# EAGLE design PCB-BI8-2x5RGB (EAGLE 6.4)

## Sheet 1 of 2
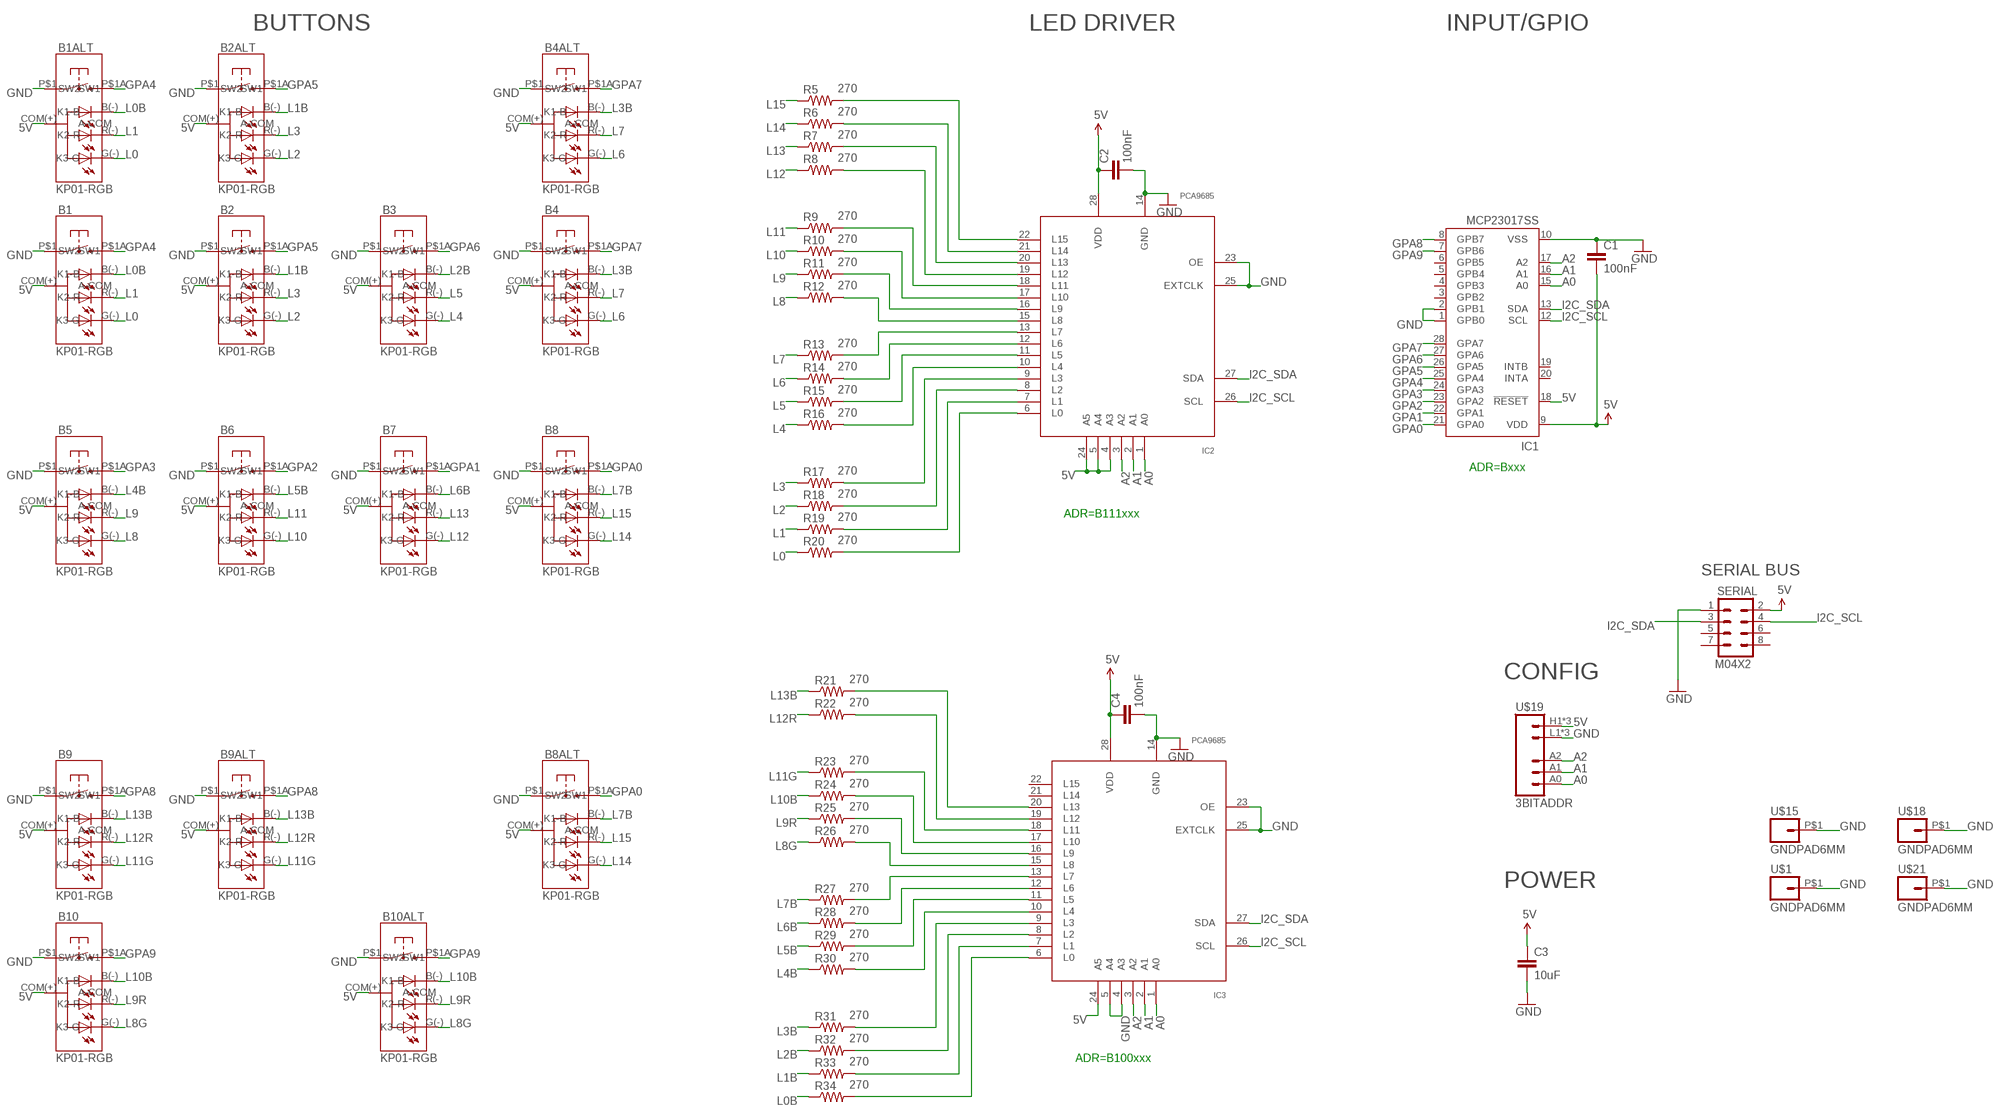
[diagram p0: schematic, sheet 1]

### Parts
B1  KP01-RGB  NKK-KP01  [NKK-KP01]
B1ALT  KP01-RGB  NKK-KP01  [NKK-KP01]
B2  KP01-RGB  NKK-KP01  [NKK-KP01]
B2ALT  KP01-RGB  NKK-KP01  [NKK-KP01]
B3  KP01-RGB  NKK-KP01  [NKK-KP01]
B4  KP01-RGB  NKK-KP01  [NKK-KP01]
B4ALT  KP01-RGB  NKK-KP01  [NKK-KP01]
B5  KP01-RGB  NKK-KP01  [NKK-KP01]
B6  KP01-RGB  NKK-KP01  [NKK-KP01]
B7  KP01-RGB  NKK-KP01  [NKK-KP01]
B8  KP01-RGB  NKK-KP01  [NKK-KP01]
B8ALT  KP01-RGB  NKK-KP01  [NKK-KP01]
B9  KP01-RGB  NKK-KP01  [NKK-KP01]
B9ALT  KP01-RGB  NKK-KP01  [NKK-KP01]
B10  KP01-RGB  NKK-KP01  [NKK-KP01]
B10ALT  KP01-RGB  NKK-KP01  [NKK-KP01]
C1  100nF  CAP0603-CAP  [0603-CAP]
C2  100nF  CAP0603-CAP  [0603-CAP]
C3  10uF  CAP0805  [0805]
C4  100nF  CAP0603-CAP  [0603-CAP]
IC1  MCP23017SS  [SSOP28]
IC2  PCA9685  [TSSOP28]
IC3  PCA9685  [TSSOP28]
R5  270  RESISTOR0603-RES  [0603-RES]
R6  270  RESISTOR0603-RES  [0603-RES]
R7  270  RESISTOR0603-RES  [0603-RES]
R8  270  RESISTOR0603-RES  [0603-RES]
R9  270  RESISTOR0603-RES  [0603-RES]
R10  270  RESISTOR0603-RES  [0603-RES]
R11  270  RESISTOR0603-RES  [0603-RES]
R12  270  RESISTOR0603-RES  [0603-RES]
R13  270  RESISTOR0603-RES  [0603-RES]
R14  270  RESISTOR0603-RES  [0603-RES]
R15  270  RESISTOR0603-RES  [0603-RES]
R16  270  RESISTOR0603-RES  [0603-RES]
R17  270  RESISTOR0603-RES  [0603-RES]
R18  270  RESISTOR0603-RES  [0603-RES]
R19  270  RESISTOR0603-RES  [0603-RES]
R20  270  RESISTOR0603-RES  [0603-RES]
R21  270  RESISTOR0603-RES  [0603-RES]
R22  270  RESISTOR0603-RES  [0603-RES]
R23  270  RESISTOR0603-RES  [0603-RES]
R24  270  RESISTOR0603-RES  [0603-RES]
R25  270  RESISTOR0603-RES  [0603-RES]
R26  270  RESISTOR0603-RES  [0603-RES]
R27  270  RESISTOR0603-RES  [0603-RES]
R28  270  RESISTOR0603-RES  [0603-RES]
R29  270  RESISTOR0603-RES  [0603-RES]
R30  270  RESISTOR0603-RES  [0603-RES]
R31  270  RESISTOR0603-RES  [0603-RES]
R32  270  RESISTOR0603-RES  [0603-RES]
R33  270  RESISTOR0603-RES  [0603-RES]
R34  270  RESISTOR0603-RES  [0603-RES]
SERIAL  M04X2  [2X4]
U$1  GNDPAD6MM  [3.2MMPAD6MM]
U$15  GNDPAD6MM  [3.2MMPAD6MM]
U$18  GNDPAD6MM  [3.2MMPAD6MM]
U$19  3BITADDR  [3BITADDR]
U$21  GNDPAD6MM  [3.2MMPAD6MM]

### Nets
5V [Power]: B1.COM(+)(A-COM) B1ALT.COM(+)(A-COM) B2.COM(+)(A-COM) B2ALT.COM(+)(A-COM) B3.COM(+)(A-COM) B4.COM(+)(A-COM) B4ALT.COM(+)(A-COM) B5.COM(+)(A-COM) B6.COM(+)(A-COM) B7.COM(+)(A-COM) B8.COM(+)(A-COM) B8ALT.COM(+)(A-COM) B9.COM(+)(A-COM) B9ALT.COM(+)(A-COM) B10.COM(+)(A-COM) B10ALT.COM(+)(A-COM) C1.2 C2.1 C3.1 C4.1 IC1.9(VDD) IC1.18(!RESET) IC2.4(A3) IC2.5(A4) IC2.24(A5) IC2.28(VDD) IC3.24(A5) IC3.28(VDD) SERIAL.2 U$19.H1(VCC) U$19.H2(VCC) U$19.H3(VCC)
A0: IC1.15(A0) IC2.1(A0) IC3.1(A0) U$19.A0
A1: IC1.16(A1) IC2.2(A1) IC3.2(A1) U$19.A1
A2: IC1.17(A2) IC2.3(A2) IC3.3(A2) U$19.A2
GND [Power]: B1.P$1(SW1) B1ALT.P$1(SW1) B2.P$1(SW1) B2ALT.P$1(SW1) B3.P$1(SW1) B4.P$1(SW1) B4ALT.P$1(SW1) B5.P$1(SW1) B6.P$1(SW1) B7.P$1(SW1) B8.P$1(SW1) B8ALT.P$1(SW1) B9.P$1(SW1) B9ALT.P$1(SW1) B10.P$1(SW1) B10ALT.P$1(SW1) C1.1 C2.2 C3.2 C4.2 IC1.1(GPB0) IC1.2(GPB1) IC1.10(VSS) IC2.14(GND) IC2.23(OE) IC2.25(EXTCLK) IC3.4(A3) IC3.5(A4) IC3.14(GND) IC3.23(OE) IC3.25(EXTCLK) SERIAL.1 U$1.P$1 U$15.P$1 U$18.P$1 U$19.L1(GND) U$19.L2(GND) U$19.L3(GND) U$21.P$1
GPA0: B8.P$1A(SW2) B8ALT.P$1A(SW2) IC1.21(GPA0)
GPA1: B7.P$1A(SW2) IC1.22(GPA1)
GPA2: B6.P$1A(SW2) IC1.23(GPA2)
GPA3: B5.P$1A(SW2) IC1.24(GPA3)
GPA4: B1.P$1A(SW2) B1ALT.P$1A(SW2) IC1.25(GPA4)
GPA5: B2.P$1A(SW2) B2ALT.P$1A(SW2) IC1.26(GPA5)
GPA6: B3.P$1A(SW2) IC1.27(GPA6)
GPA7: B4.P$1A(SW2) B4ALT.P$1A(SW2) IC1.28(GPA7)
GPA8: B9.P$1A(SW2) B9ALT.P$1A(SW2) IC1.8(GPB7)
GPA9: B10.P$1A(SW2) B10ALT.P$1A(SW2) IC1.7(GPB6)
I2C_SCL: IC1.12(SCL) IC2.26(SCL) IC3.26(SCL) SERIAL.4
I2C_SDA: IC1.13(SDA) IC2.27(SDA) IC3.27(SDA) SERIAL.3
L0: B1.G(-)(K3-G) B1ALT.G(-)(K3-G) R20.1
L0B: B1.B(-)(K1-B) B1ALT.B(-)(K1-B) R34.1
L1: B1.R(-)(K2-R) B1ALT.R(-)(K2-R) R19.1
L1B: B2.B(-)(K1-B) B2ALT.B(-)(K1-B) R33.1
L2: B2.G(-)(K3-G) B2ALT.G(-)(K3-G) R18.1
L2B: B3.B(-)(K1-B) R32.1
L3: B2.R(-)(K2-R) B2ALT.R(-)(K2-R) R17.1
L3B: B4.B(-)(K1-B) B4ALT.B(-)(K1-B) R31.1
L4: B3.G(-)(K3-G) R16.1
L4B: B5.B(-)(K1-B) R30.1
L5: B3.R(-)(K2-R) R15.1
L5B: B6.B(-)(K1-B) R29.1
L6: B4.G(-)(K3-G) B4ALT.G(-)(K3-G) R14.1
L6B: B7.B(-)(K1-B) R28.1
L7: B4.R(-)(K2-R) B4ALT.R(-)(K2-R) R13.1
L7B: B8.B(-)(K1-B) B8ALT.B(-)(K1-B) R27.1
L8: B5.G(-)(K3-G) R12.1
L8G: B10.G(-)(K3-G) B10ALT.G(-)(K3-G) R26.1
L9: B5.R(-)(K2-R) R11.1
L9R: B10.R(-)(K2-R) B10ALT.R(-)(K2-R) R25.1
L10: B6.G(-)(K3-G) R10.1
L10B: B10.B(-)(K1-B) B10ALT.B(-)(K1-B) R24.1
L11: B6.R(-)(K2-R) R9.1
L11G: B9.G(-)(K3-G) B9ALT.G(-)(K3-G) R23.1
L12: B7.G(-)(K3-G) R8.1
L12R: B9.R(-)(K2-R) B9ALT.R(-)(K2-R) R22.1
L13: B7.R(-)(K2-R) R7.1
L13B: B9.B(-)(K1-B) B9ALT.B(-)(K1-B) R21.1
L14: B8.G(-)(K3-G) B8ALT.G(-)(K3-G) R6.1
L15: B8.R(-)(K2-R) B8ALT.R(-)(K2-R) R5.1
N$2: IC3.13(L7) R27.2
N$3: IC3.12(L6) R28.2
N$4: IC2.13(L7) R13.2
N$5: IC2.12(L6) R14.2
N$6: IC3.11(L5) R29.2
N$7: IC2.11(L5) R15.2
N$9: IC2.10(L4) R16.2
N$10: IC2.9(L3) R17.2
N$11: IC2.8(L2) R18.2
N$12: IC2.7(L1) R19.2
N$13: IC3.10(L4) R30.2
N$14: IC3.9(L3) R31.2
N$15: IC3.8(L2) R32.2
N$16: IC3.7(L1) R33.2
N$17: IC3.6(L0) R34.2
N$18: IC3.15(L8) R26.2
N$19: IC2.6(L0) R20.2
N$20: IC2.15(L8) R12.2
N$21: IC2.16(L9) R11.2
N$22: IC2.17(L10) R10.2
N$23: IC2.18(L11) R9.2
N$24: IC2.19(L12) R8.2
N$25: IC2.20(L13) R7.2
N$26: IC2.21(L14) R6.2
N$27: IC2.22(L15) R5.2
N$28: IC3.16(L9) R25.2
N$29: IC3.17(L10) R24.2
N$30: IC3.18(L11) R23.2
N$31: IC3.19(L12) R22.2
N$32: IC3.20(L13) R21.2
Unconnected: IC1.3(GPB2) IC1.4(GPB3) IC1.5(GPB4) IC1.6(GPB5) IC1.19(INTB) IC1.20(INTA) IC3.21(L14) IC3.22(L15) SERIAL.5 SERIAL.6 SERIAL.7 SERIAL.8

### Notes on the sheet
- BUTTONS | LED DRIVER | INPUT/GPIO
- ADR=Bxxx
- ADR=B111xxx
- SERIAL BUS
- CONFIG
- POWER
- ADR=B100xxx

## Sheet 2 of 2

## Library data of the parts
B1 B1ALT B2 B2ALT B3 B4 B4ALT B5-B8 B8ALT B9 B9ALT B10 B10ALT = SKAARHOJ:NKK-KP01: NKK-KP01-15AC 100mA12VDC
C1-C4 = SparkFun:CAP: Capacitor Standard 0603 ceramic capacitor, and 0.1" leaded capacitor.
IC1 = microchip:MCP23017: http://ww1.microchip.com/downloads/en/DeviceDoc/21952a.pdf Source: http://ww1.microchip.com/downloads/en/DeviceDoc/21952a.pdf; MF: MICROCHIP; MPN: MCP23017-E/SS; OC_FARNELL: 1467674; OC_NEWARK: 31K2960
IC2 IC3 = wsmith:PCA9685
R5-R34 = SparkFun:RESISTOR: Resistor Basic schematic elements and footprints for 0603, 1206, and PTH resistors.
SERIAL = SparkFun:M04X2
U$1 U$15 U$18 U$21 = SKAARHOJ:GNDPAD
U$19 = SKAARHOJ:3BITADDR

## Net classes
0 default: width 0.152 mm, drill 0.254 mm, clearance 0.152 mm
1 Power: width 0.406 mm, drill 0.61 mm, clearance 0.203 mm

## Board
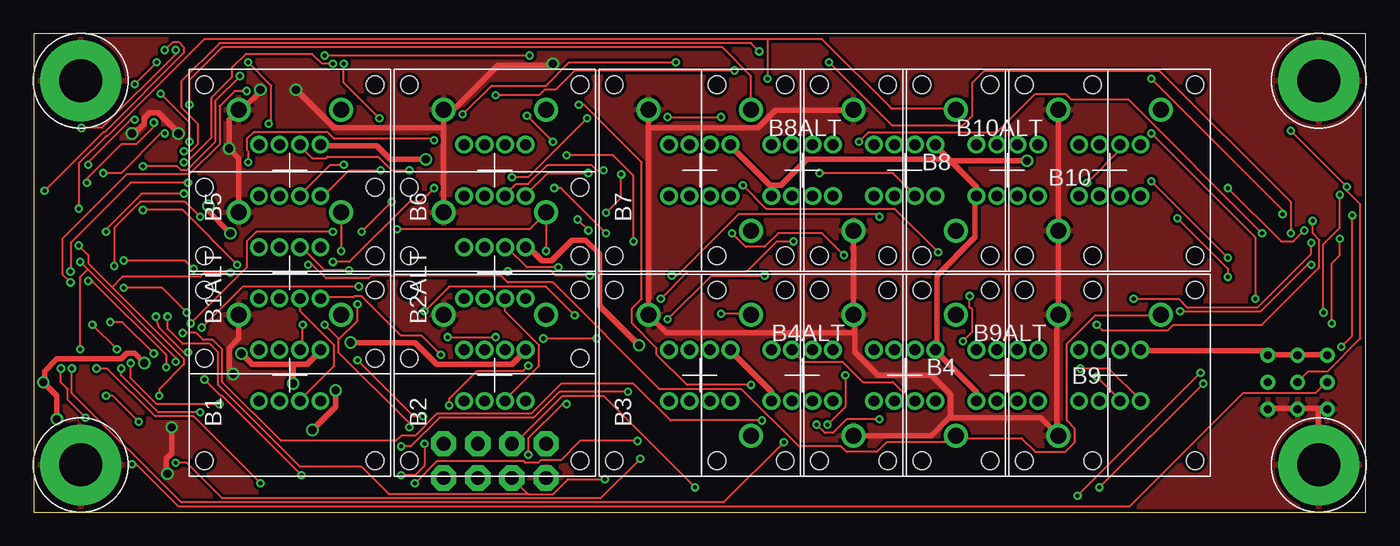
[diagram p1: board, top side]
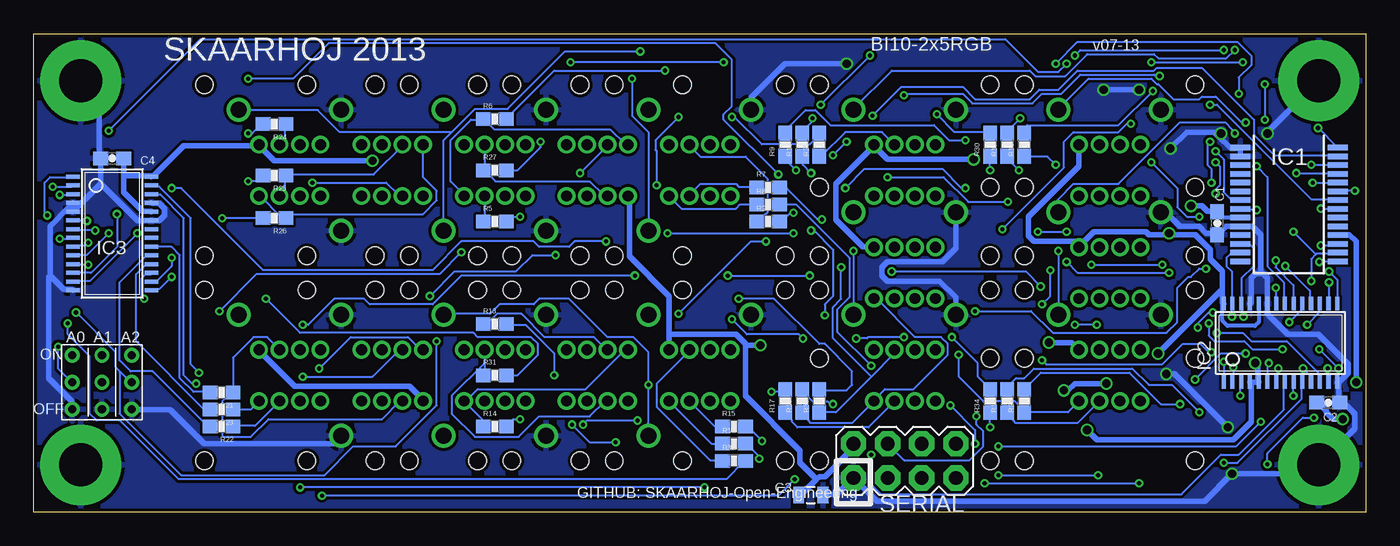
[diagram p2: board, bottom side, seen from below]

Size 99.06 x 35.56 mm. Coordinates in mm from the lower left corner, seen from the top.
Outline: 0,0 99.06,0 99.06,35.56 0,35.56 0,0
Copper layers (1*16): Top 0.035mm / dielectric 1.5mm / Bottom 0.035mm
Design rules "Fusion_eagle_rule_v1.1": minimum track width 6mil, minimum drill 12mil, track to track 6mil, track to pad 6mil, pad to pad 6mil, via to via 6mil, smd to smd 0mil, copper to edge 10mil, drill to drill 10mil, minimum pad ring 10mil, minimum via ring 6mil, stop-mask expansion 2mil, vias tented up to drill 100mil, thermal gap 10mil

### Footprints (pad centres in the part's own frame; a part is rotated, then mirrored left to right if it is on the bottom)
NKK-KP01 = drill 0.8: B(-) 1.905,-0.762; COM(+) 1.905,-2.286; G(-) -1.905,-2.286; P$3 1.905,0.762; P$4 1.905,2.286; P$7 -1.905,0.762; P$8 -1.905,2.286; R(-) -1.905,-0.762 | drill 1.2: P$1 4.496,3.81; P$1A 4.496,-3.81 | hole 1.3: -6.35,6.35; 6.35,6.35; 6.35,-6.35; -6.35,-6.35
0603-CAP = smd 1.1 x 1: 1 -0.85,0; 2 0.85,0
0805 = smd 0.8 x 1.2: 1 -0.9,0; 2 0.9,0
SSOP28 = smd 0.4 x 1.5: 1 -4.225,-3.625; 2 -3.575,-3.625; 3 -2.925,-3.625; 4 -2.275,-3.625; 5 -1.625,-3.625; 6 -0.975,-3.625; 7 -0.325,-3.625; 8 0.325,-3.625; 9 0.975,-3.625; 10 1.625,-3.625; 11 2.275,-3.625; 12 2.925,-3.625; 13 3.575,-3.625; 14 4.225,-3.625; 15 4.225,3.625; 16 3.575,3.625; 17 2.925,3.625; 18 2.275,3.625; 19 1.625,3.625; 20 0.975,3.625; 21 0.325,3.625; 22 -0.325,3.625; 23 -0.975,3.625; 24 -1.625,3.625; 25 -2.275,3.625; 26 -2.925,3.625; 27 -3.575,3.625; 28 -4.225,3.625
TSSOP28 = smd 0.305 x 0.991: 1 -4.225,-2.918; 2 -3.575,-2.918; 3 -2.925,-2.918; 4 -2.275,-2.918; 5 -1.625,-2.918; 6 -0.975,-2.918; 7 -0.325,-2.918; 8 0.325,-2.918; 9 0.975,-2.918; 10 1.625,-2.918; 11 2.275,-2.918; 12 2.925,-2.918; 13 3.575,-2.918; 14 4.225,-2.918; 15 4.225,2.918; 16 3.575,2.918; 17 2.925,2.918; 18 2.275,2.918; 19 1.625,2.918; 20 0.975,2.918; 21 0.325,2.918; 22 -0.325,2.918; 23 -0.975,2.918; 24 -1.625,2.918; 25 -2.275,2.918; 26 -2.925,2.918; 27 -3.575,2.918; 28 -4.225,2.918
0603-RES = smd 1.1 x 1: 1 -0.85,0; 2 0.85,0
2X4 = drill 1.016 pad 1.88 octagon: 1 -3.81,-1.27; 2 -3.81,1.27; 3 -1.27,-1.27; 4 -1.27,1.27; 5 1.27,-1.27; 6 1.27,1.27; 7 3.81,-1.27; 8 3.81,1.27
3.2MMPAD6MM = drill 3.2 pad 6: P$1 0,0
3BITADDR = drill 0.6: A0 -2.2,0; A1 0,0; A2 2.2,0; H1 -2.2,2; H2 0,2; H3 2.2,2; L1 -2.2,-2; L2 0,-2; L3 2.2,-2

### Placement (x,y rotation side)
B1  19.05,10.16 90 top
B1ALT  19.05,17.78 90 top
B2  34.29,10.16 90 top
B2ALT  34.29,17.78 90 top
B3  49.53,10.16 90 top
B4  64.77,10.16 90 top
B4ALT  57.15,10.16 270 top
B5  19.05,25.4 90 top
B6  34.29,25.4 90 top
B7  49.53,25.4 90 top
B8  64.77,25.4 90 top
B8ALT  57.15,25.4 270 top
B9  80.01,10.16 90 top
B9ALT  72.39,10.16 270 top
B10  80.01,25.4 90 top
B10ALT  72.39,25.4 270 top
C1  11.05,21.46 90 bottom
C2  2.79,8.13 0 bottom
C3  41.27,1.27 0 bottom
C4  93.22,26.29 180 bottom
IC1  5.71,22.86 270 bottom
IC2  6.35,12.57 0 bottom
IC3  93.22,20.7 270 bottom
R5  64.77,21.59 0 bottom
R6  64.77,29.21 0 bottom
R7  44.45,24.13 0 bottom
R8  44.45,22.86 0 bottom
R9  43.18,27.3 90 bottom
R10  41.91,27.3 90 bottom
R11  25.4,27.3 90 bottom
R12  26.67,27.3 90 bottom
R13  64.77,13.97 0 bottom
R14  64.77,6.35 0 bottom
R15  46.99,6.35 0 bottom
R16  46.99,5.08 0 bottom
R17  43.18,8.26 90 bottom
R18  41.91,8.26 90 bottom
R19  26.67,8.26 90 bottom
R20  25.4,8.26 90 bottom
R21  85.09,8.89 180 bottom
R22  85.09,6.35 180 bottom
R23  85.09,7.62 180 bottom
R24  81.15,28.83 180 bottom
R25  81.15,25.02 180 bottom
R26  81.15,21.84 180 bottom
R27  64.77,25.4 0 bottom
R28  44.45,21.59 0 bottom
R29  40.64,27.3 90 bottom
R30  27.94,27.3 90 bottom
R31  64.77,10.16 0 bottom
R32  46.99,3.81 0 bottom
R33  40.64,8.26 90 bottom
R34  27.94,8.26 90 bottom
SERIAL  34.29,3.81 0 bottom
U$1  3.5,3.5 0 top
U$15  3.5,32.06 0 top
U$18  95.56,32.06 0 top
U$19  93.98,9.65 0 bottom
U$21  95.56,3.5 0 top

### Tracks (layer width: path | path; a pad name or v marks a point on that pad's centre or on a via)
5V  (via drill 0.61)
  Top 0.406: v1.73,6.91 1.73,8.64 v0.71,9.65 0.81,9.75 0.81,10.46 1.73,11.38 6.5,11.38 6.91,11.79 7.52,11.79 v8.23,11.07 | v13.01,22.76 13.01,22.35 v14.63,20.73 | 19.3,10.97 16.26,10.97 v15.44,11.79 | 19.3,10.97 20.32,10.97 21.34,11.99 B1.COM(+) | v23.57,12.6 28.35,12.6 29.97,10.97 35.56,10.97 36.58,11.99 B2.COM(+) | v29.16,26.21 26.52,26.21 25.5,27.23 21.34,27.23 B5.COM(+) | v20.73,6.1 22.45,7.82 v22.45,9.04 | 19.3,10.97 v19.3,9.55 | B4ALT.COM(+) 54.86,8.94 51.82,11.99 B3.COM(+) | 54.86,24.18 B8ALT.COM(+) | 54.86,24.18 51.82,27.23 B7.COM(+) | U$19.H1 96.11,11.68 94.08,11.68 U$19.H2 93.98,11.68 91.85,11.68 U$19.H3 91.64,11.79 91.44,11.99 82.3,11.99 B9.COM(+) | B9ALT.COM(+) 70.1,8.94 67.06,11.99 B4.COM(+) 67.16,12.19 67.16,17.58 70,20.42 70,23.37 B10ALT.COM(+) 70.1,24.18 68.28,26.01 | 67.97,26.31 67.06,27.23 B8.COM(+) | 67.97,26.31 68.28,26.01 | v73.86,26.11 68.38,26.11 68.28,26.01 | 54.86,24.18 54.97,24.28 55.58,24.28 57.51,26.21 67.87,26.21 67.97,26.31 | v45.01,12.39 42.06,15.34 42.06,19.2 41.05,20.22 40.03,20.22 38.51,18.69 37.8,18.69 36.88,19.61 36.58,19.61 B2ALT.COM(+)
  Bottom 0.305: IC1.9 10.62,21.89 C1.2 | IC2.24 7.97,14.12 8.26,13.84 10.29,13.84 10.67,14.22 10.67,15.4 IC2.28
  Bottom 0.406: v1.73,6.91 2.44,6.91 2.95,7.42 2.95,7.52 3.56,8.13 C2.1 | v0.71,9.65 0.71,20.12 1.22,20.62 2.03,20.62 IC1.18 | v8.23,11.07 8.03,10.87 8.03,9.86 IC2.5 8.03,9.65 8.53,9.65 IC2.4 8.53,9.45 8.53,6.71 9.86,5.38 20.02,5.38 v20.73,6.1 | B2ALT.COM(+) 36.58,19.71 37.39,19.71 39.42,21.74 39.42,24.38 36.58,27.23 B6.COM(+) 36.47,27.13 35.56,26.21 v29.16,26.21 | 10.67,16.46 10.67,17.88 11.58,18.8 11.58,19.51 12.7,20.62 14.63,20.62 | 10.67,16.46 10.67,15.54 IC2.28 | 14.63,20.62 16.15,20.62 16.36,20.83 20.22,20.83 21.34,19.71 B1ALT.COM(+) 21.13,20.12 24.69,20.12 25.09,20.52 25.09,21.95 21.34,25.7 B5.COM(+) | v13.01,22.76 12.19,22.76 11.79,22.35 11.07,22.35 C1.2 | v14.63,20.73 14.63,20.62 | v15.44,11.79 10.77,16.46 10.67,16.46 | v23.57,12.6 21.84,12.6 21.34,12.09 B1.COM(+) | v22.45,9.04 22.15,9.04 21.64,9.55 v19.3,9.55 | 40.84,2.44 40.64,2.64 40.23,2.64 38.1,4.78 SERIAL.2 | 40.84,2.44 41.96,1.32 42.16,1.32 C3.1 | 51.82,13.21 51.82,16.05 54.76,19 54.76,23.37 54.86,23.47 B8ALT.COM(+) | 51.82,13.21 B3.COM(+) | 40.84,2.44 42.06,3.66 42.06,4.57 46.13,8.64 46.13,12.39 | 46.13,12.39 46.13,12.5 46.84,13.21 51.82,13.21 | 92.35,24.99 92.35,26.21 C4.1 | 92.35,24.99 92.35,23.77 90.93,22.35 90.32,22.35 IC3.24 | 92.35,24.99 90.32,24.99 IC3.28 90.12,24.99 87.88,27.23 82.3,27.23 B10.COM(+) 82.19,27.13 81.18,26.11 v73.86,26.11 | B9.COM(+) 82.3,11.99 79.65,9.35 71.12,9.35 70.1,8.33 B9ALT.COM(+) | 46.13,12.39 v45.01,12.39
A0  (via drill 0.3)
  Top 0.152: v10.57,11.18 10.57,11.48 4.01,18.03 | v3.45,18.59 4.01,18.03 | v98.04,22.05 98.04,13.11 v97.23,12.29 | 4.01,18.03 3.45,17.48 v3.45,12.09 | v2.03,10.67 2.03,9.65 2.54,9.14 2.54,8.33 v3.86,7.01 | v7.32,3.56 7.62,3.56 10.77,0.41 81.48,0.41 89.92,8.84 95.3,8.84 96.11,9.65 U$19.A0
  Bottom 0.152: v10.57,11.18 10.57,9.75 IC2.1 | v3.45,18.59 2.13,18.59 IC1.15 | v98.04,22.05 98.25,22.25 98.25,24.49 97.84,24.89 96.22,24.89 IC3.1 | v97.23,12.29 97.23,10.67 96.22,9.65 U$19.A0 | v2.03,10.67 v3.45,12.09 | v3.86,7.01 4.67,7.01 7.32,4.37 v7.32,3.56
A1  (via drill 0.3)
  Top 0.152: v9.86,10.77 9.86,11.68 4.37,17.17 v4.06,17.17 | U$19.A1 94.79,10.46 96.22,10.46 98.65,12.9 98.65,22.86 97.64,23.88 v97.64,24.18 v93.47,28.35 | v5.38,20.83 5.38,21.03 8.03,23.67 v11.18,23.67 | v11.18,26.01 11.38,26.01 13.21,27.84 13.21,30.79 14.73,32.31 14.73,33.02 15.75,34.04 20.73,34.04 21.44,33.33 v22.25,33.33
  Bottom 0.152: v9.86,10.77 9.86,9.75 IC2.2 | v4.06,17.17 4.06,18.8 3.71,19.15 | 3.71,19.15 3.66,19.2 2.13,19.2 IC1.16 | v97.64,24.18 96.22,24.18 IC3.2 | v5.38,20.83 3.71,19.15 | v11.18,23.67 11.18,23.98 10.87,24.28 10.87,25.7 v11.18,26.01 | v22.25,33.33 22.86,32.72 24.38,32.72 26.82,35.15 86.67,35.15 v93.47,28.35
A2  (via drill 0.3)
  Top 0.152: v9.35,8.64 9.35,9.14 11.18,10.97 11.18,11.38 5.84,16.71 | 5.84,16.71 4.06,18.49 4.06,19.1 v3.35,19.81 | v97.13,23.57 97.13,21.13 95.91,19.91 v95.91,14.83 | 5.84,16.71 6.6,17.48 12.39,17.48 12.7,17.78 v14.63,17.78 | v22.25,18.59 23.47,18.59 27.94,23.06 28.75,23.06 v29.77,24.08 | v38.71,24.08 39.22,24.08 v42.57,20.73 | v51.92,20.73 52.93,19.71 54.36,19.71 55.37,20.73 58.62,20.73 v60.25,19.1 | v69.6,16.05 69.6,15.24 69.8,15.04 69.8,13.41 v69.09,12.7
  Bottom 0.152: v9.35,8.64 9.35,9.65 IC2.3 | v3.35,19.81 2.23,19.81 2.13,19.91 IC1.17 | v97.13,23.57 96.22,23.57 IC3.3 | v95.91,14.83 92.96,11.89 92.96,10.77 92.61,10.41 | 92.61,10.41 91.85,9.65 U$19.A2 | v14.63,17.78 21.44,17.78 v22.25,18.59 | v29.77,24.08 30.07,24.08 31.5,25.5 37.29,25.5 v38.71,24.08 | v51.92,20.73 v42.57,20.73 | v60.25,19.1 61.98,19.1 63.2,17.88 67.77,17.88 v69.6,16.05 | v69.09,12.7 69.09,7.92 72.14,4.88 75.29,4.88 77.42,2.74 88.09,2.74 92.66,7.32 92.66,10.36 92.61,10.41
GND  (via drill 0.61)
  Top 0.406: B1ALT.P$1 15.24,26.31 v14.53,27.03 14.53,29.16 15.24,29.87 B5.P$1 15.34,30.07 15.65,30.07 16.87,31.29 v16.87,31.39 | B1.P$1 15.24,12.9 14.53,12.19 14.53,10.57 v14.83,10.26 | v10.26,6.3 10.26,4.37 9.86,3.96 9.86,2.95 v9.96,2.85 | v7.32,28.14 7.52,28.14 8.23,28.85 8.23,29.26 8.64,29.67 9.25,29.67 v10.77,28.14 | U$19.L3 91.85,7.72 93.98,7.72 U$19.L2 94.08,7.72 95.5,7.72 | 95.5,7.72 96.11,7.72 U$19.L1 | 95.5,7.72 95.5,3.56 U$21.P$1 | B10.P$1 B10ALT.P$1 B9.P$1 76.1,14.53 76.1,5.99 B9ALT.P$1 76.2,5.69 74.88,7.01 68.07,7.01 | B8ALT.P$1 B4.P$1 61.06,14.53 61.06,13.31 | 68.07,7.01 66.75,5.69 60.96,5.69 B4ALT.P$1 | 61.06,13.31 61.06,11.89 62.79,10.16 66.75,10.16 68.17,8.74 68.17,7.11 68.07,7.01 | B2ALT.P$1 30.48,28.55 | 30.48,28.55 B6.P$1 30.58,30.07 31.39,30.07 34.54,33.22 38.51,33.22 v38.61,33.33 | B7.P$1 45.72,28.55 | 45.72,28.55 B3.P$1 45.82,14.53 47.04,13.31 61.06,13.31 | 45.72,28.55 53.85,28.55 55.17,29.87 60.96,29.87 B8.P$1 | v19.51,31.39 22.35,28.55 30.48,28.55
  Bottom 0.406: 7.82,17.73 8.23,17.73 8.53,17.42 8.53,15.54 IC2.25 | 7.82,17.73 7.62,17.73 7.32,17.42 7.32,15.54 IC2.23 7.32,15.34 7.32,14.73 5.79,13.21 3.56,13.21 1.32,10.97 1.32,10.36 2.03,9.65 | 7.82,17.73 7.82,20.62 8.43,21.23 9.14,21.23 IC1.10 10.36,21.23 10.97,20.62 C1.1 11.18,20.73 11.89,20.73 12.39,21.23 13.82,21.23 14.83,22.25 15.24,22.25 B1ALT.P$1 | IC1.2 9.35,26.52 9.35,27.03 IC1.1 9.55,27.03 10.06,27.03 10.97,27.94 | 10.97,27.94 11.28,28.25 13.31,28.25 v14.53,27.03 | C3.2 40.34,1.32 39.32,1.32 SERIAL.1 36.37,0.81 11.99,0.81 v9.96,2.85 4.27,2.85 3.66,3.45 U$1.P$1 3.45,3.56 0.81,6.2 0.81,7.32 1.52,8.03 1.83,8.03 C2.2 2.03,8.13 2.03,9.65 | 2.03,9.65 IC2.14 | v14.83,10.26 14.22,10.26 v10.26,6.3 | U$15.P$1 7.32,28.25 v7.32,28.14 | v10.77,28.14 10.97,27.94 | IC3.25 90.22,22.96 89.71,22.96 89.31,22.55 89.31,22.05 89.71,21.64 90.22,21.64 IC3.23 90.42,21.64 91.34,21.64 94.08,24.38 | 97.84,17.58 96.83,16.56 96.22,16.56 IC3.14 | 97.84,17.58 97.84,21.23 96.47,22.61 | 96.47,22.61 96.11,22.96 IC3.4 | 96.47,22.61 96.22,22.35 IC3.5 96.01,22.45 94.08,24.38 | 94.08,24.38 94.08,26.21 C4.2 94.18,26.42 94.18,30.68 U$18.P$1 | U$19.L1 96.22,7.72 96.22,8.23 97.94,9.96 97.94,17.48 97.84,17.58 | B2.P$1 30.48,15.95 31.7,17.17 35.56,17.17 35.97,17.58 35.97,18.19 35.56,18.59 31.5,18.59 30.48,19.61 B2ALT.P$1 | v38.61,33.33 43.18,33.33 45.72,30.79 B7.P$1 | U$19.L3 91.75,7.62 88.9,7.62 86.36,5.08 76.71,5.08 76.2,5.59 B9ALT.P$1 | v19.51,31.39 v16.87,31.39
  pour Top: 0,0 99.06,0 99.06,35.56 0,35.56
  pour Bottom: 0,0 99.06,0 99.06,35.56 0,35.56
GPA0  (via drill 0.3)
  Top 0.152: v3.35,22.55 3.35,25.91 5.38,27.94 5.49,27.94 12.7,35.15 54.56,35.15 | 54.56,35.15 58.62,35.15 63.8,29.97 68.58,29.97 B8.P$1A | 54.56,35.15 v54.56,32.21
  Bottom 0.152: v3.35,22.55 2.13,22.55 IC1.21 | B8ALT.P$1A 53.34,28.25 54.56,29.46 v54.56,32.21
GPA1  (via drill 0.3)
  Top 0.152: v11.58,30.28 11.58,32.11 14.02,34.54 51.21,34.54 53.34,32.41 B7.P$1A
  Bottom 0.152: v11.58,30.28 11.07,30.28 4.06,23.27 2.13,23.27 IC1.22
GPA2  (via drill 0.3)
  Top 0.152: v0.81,23.88 5.18,28.25 5.28,28.25 11.18,34.14 11.18,34.54 10.77,34.95 10.36,34.95 v9.75,34.34
  Bottom 0.152: v0.81,23.88 2.03,23.88 IC1.23 | v9.75,34.34 10.36,33.73 15.44,33.73 15.75,34.04 20.73,34.04 22.35,32.41 24.59,32.41 24.99,32.82 35.26,32.82 38.1,29.97 B6.P$1A
GPA3  (via drill 0.3)
  Top 0.152: v3.96,24.49 3.96,24.79 6.5,27.33 7.62,27.33 8.94,28.65 v8.94,28.96
  Bottom 0.152: v3.96,24.49 2.13,24.49 IC1.24 | v8.94,28.96 9.25,28.96 11.18,30.89 12.19,30.89 12.39,30.68 14.33,30.68 15.44,31.8 15.54,31.8 15.95,32.21 20.62,32.21 22.86,29.97 B5.P$1A
GPA4  (via drill 0.3)
  Top 0.152: v5.18,25.2 6.5,25.2 9.45,28.14 v9.75,28.14 | B1ALT.P$1A v22.86,19.41
  Bottom 0.152: v5.18,25.2 2.13,25.2 IC1.25 | v9.75,28.14 9.96,28.35 9.96,28.45 10.46,28.96 13.82,28.96 18.39,24.38 21.74,24.38 22.86,23.27 B1ALT.P$1A | v22.86,19.41 B1.P$1A
GPA5  (via drill 0.3)
  Top 0.152: v4.06,25.81 4.06,26.01 7.21,29.16 v7.52,29.16 | v9.14,33.43 v7.52,31.8 | v15.95,33.43 17.68,31.7 17.68,29.06 v17.48,28.85 | v27.03,21.03 36.88,21.03 38.1,22.25 B2ALT.P$1A v38.1,19.41
  Bottom 0.152: v4.06,25.81 2.13,25.81 IC1.26 | v7.52,31.8 v7.52,29.16 | v15.95,33.43 v9.14,33.43 | v17.48,28.85 17.78,28.85 18.39,28.25 21.74,28.25 22.45,27.53 22.45,25.6 v27.03,21.03 | v38.1,19.41 B2.P$1A
GPA6  (via drill 0.3)
  Top 0.152: v38.61,27.53 v36.68,29.46 | v39.62,26.52 43.08,26.52 44.6,24.99 v44.6,20.12 | v51.1,14.73 53.34,14.73 B3.P$1A
  Bottom 0.152: v36.68,29.46 34.54,31.6 29.97,31.6 29.06,30.68 24.99,30.68 24.28,31.39 22.86,31.39 21.44,32.82 15.75,32.82 15.54,33.02 12.19,33.02 8.33,29.16 8.33,28.04 6.81,26.52 2.13,26.52 IC1.27 | v39.62,26.52 v38.61,27.53 | v44.6,20.12 45.72,20.12 v51.1,14.73
GPA7  (via drill 0.3)
  Top 0.152: v3.56,28.55 5.08,28.55 10.57,34.04 v10.57,34.34 | v36.88,33.93 v21.64,33.93 | v40.54,30.28 40.95,30.28 45.21,26.01 45.21,15.85 44.5,15.14 44.5,14.02 46.33,12.19 46.33,11.68 48.56,9.45 v53.34,9.45
  Bottom 0.152: v3.56,28.55 2.13,27.13 IC1.28 | v10.57,34.34 21.23,34.34 v21.64,33.93 | v40.54,30.28 v36.88,33.93 | B4ALT.P$1A v53.34,9.45 53.34,11.89 54.46,13.01 56.39,13.01 59.23,15.85 61.47,15.85 61.87,15.44 64.41,15.44 65.13,14.73 68.58,14.73 B4.P$1A
GPA8  (via drill 0.3)
  Top 0.152: v8.13,22.45 11.07,22.45 v15.14,18.39 | v20.42,18.39 20.73,18.39 21.74,17.37 24.89,17.37 25.09,17.58 34.75,17.58 35.26,17.07 38.61,17.07 46.53,9.14 52.63,9.14 56.9,4.88 60.05,4.88 60.45,4.47 62.69,4.47 63.4,5.18 68.17,5.18 68.58,5.59 B9ALT.P$1A 68.58,5.49 73.46,5.49 74.47,4.47 76.71,4.47 77.42,5.18 77.42,6.2 76.81,6.81 76.81,12.5 78.94,14.63 83.82,14.63 B9.P$1A
  Bottom 0.152: v8.13,22.45 9.25,22.45 IC1.8 | v20.42,18.39 v15.14,18.39
GPA9  (via drill 0.3)
  Top 0.152: v11.18,26.82 11.68,26.82 12.19,27.33 12.19,28.85 10.97,30.07 10.97,32 13.82,34.85 53.34,34.85 v53.95,34.24
  Bottom 0.152: v11.18,26.82 10.57,26.21 10.57,23.77 10.06,23.27 9.35,23.27 IC1.7 | v53.95,34.24 59.54,34.24 63.8,29.97 66.24,29.97 68.02,28.19 | 68.02,28.19 68.58,27.64 B10ALT.P$1A | B10.P$1A 83.82,29.87 77.93,29.87 76.3,28.25 68.07,28.25 68.02,28.19
I2C_SCL  (via drill 0.3)
  Top 0.152: v79.25,1.83 v86.97,9.55 | v49.17,1.83 42.37,8.64 39.32,8.64 35.76,5.08 SERIAL.4 | v9.09,14.53 9.35,13.72 11.18,11.89 v11.48,11.89 | v24.08,11.28 28.25,7.11 v28.96,7.11
  Bottom 0.152: IC1.12 9.25,19.91 8.64,19.91 8.33,19.61 8.33,18.29 9.25,17.37 9.25,15.54 IC2.26 9.35,15.44 v9.09,14.53 | v86.97,9.55 87.27,9.55 87.88,10.16 87.88,21.84 89.61,23.57 90.22,23.57 IC3.26 | v49.17,1.83 v79.25,1.83 | v11.48,11.89 11.68,11.89 12.29,12.5 13.61,12.5 15.14,10.97 23.77,10.97 v24.08,11.28 | v28.96,7.11 28.96,6.5 28.45,5.99 28.45,4.88 29.46,3.86 34.34,3.86 SERIAL.4
I2C_SDA  (via drill 0.3)
  Top 0.152: v77.62,1.22 v86.77,10.36 | v42.47,2.44 39.73,2.44 38.61,1.32 36.78,1.32 36.73,1.37 | SERIAL.3 36.73,1.37 | v9.96,14.53 9.96,13.61 11.07,12.5 13.11,12.5 13.72,11.89 13.72,9.45 19.81,3.35 24.38,3.35 26.42,1.32 36.68,1.32 36.73,1.37
  Bottom 0.152: IC1.13 9.35,19.2 10.06,19.2 10.36,18.9 10.36,18.29 9.96,17.88 9.96,15.54 IC2.27 9.96,15.44 v9.96,14.53 | v86.77,10.36 87.38,10.97 87.38,21.84 89.71,24.18 90.22,24.18 IC3.27 | v77.62,1.22 43.69,1.22 v42.47,2.44
L0  (via drill 0.3)
  Top 0.152: v30.28,11.68 28.85,13.11 27.33,13.11 24.38,16.05 23.88,16.05 23.77,15.95 21.34,15.95 B1ALT.G(-)
  Bottom 0.152: 25.3,7.42 22.15,7.42 21.34,8.23 B1.G(-) | 25.3,7.42 R20.1 25.3,7.42 | v30.28,11.68 30.28,10.06 28.45,8.23 26.11,8.23 25.3,7.42
L0B  (via drill 0.3)
  Top 0.152: v27.94,6.3 27.94,6.6 22.66,11.89 22.66,12.8 | 22.66,12.8 22.66,12.9 v21.64,13.92 | v20.02,13.92 20.02,12.29 19.81,12.09 B1.B(-) | v23.47,17.98 21.64,17.98 20.02,19.61 19.81,19.61 B1ALT.B(-) | v24.08,15.44 24.08,14.22 22.66,12.8
  Bottom 0.152: v27.94,6.3 R34.1 | v20.02,13.92 v21.64,13.92 | v23.47,17.98 23.47,16.05 v24.08,15.44
L1
  Top 0.152: B1ALT.R(-) 19.81,14.94 22.35,12.39 22.35,10.87 19.81,8.33 B1.R(-)
  Bottom 0.152: R19.1 26.62,7.32 26.21,6.91 26.21,6.81 26.01,6.6 21.44,6.6 19.81,8.23 B1.R(-)
L1B  (via drill 0.3)
  Top 0.152: v39.01,18.19 36.68,18.19 35.26,19.61 35.05,19.61 B2ALT.B(-)
  Bottom 0.152: 36.78,10.06 35.05,11.79 B2.B(-) | 36.78,10.06 39.42,7.42 R33.1 | v39.01,18.19 39.01,15.85 39.62,15.24 39.62,12.9 36.78,10.06
L2
  Bottom 0.152: R18.1 41.86,7.32 41.45,6.91 41.45,6.81 41.25,6.6 38.2,6.6 36.58,8.23 B2.G(-) 36.58,8.33 35.76,9.14 33.63,9.14 31.09,11.68 31.09,12.5 31.6,13.01 33.53,13.01 36.37,15.85 36.58,15.85 B2ALT.G(-)
L2B
  Bottom 0.152: R32.1 47.85,3.86 48.77,3.86 52.73,7.82 52.73,9.55 50.29,11.99 B3.B(-)
L3
  Top 0.152: B2ALT.R(-) 35.05,14.94 37.59,12.39 37.59,10.87 35.05,8.33 B2.R(-)
  Bottom 0.152: R17.1 43.18,7.32 42.67,6.81 42.67,6.71 42.27,6.3 36.98,6.3 35.05,8.23 B2.R(-)
L3B
  Bottom 0.152: B4.B(-) 65.53,11.07 | 65.53,11.07 65.53,10.16 R31.1 | 65.53,11.07 67.97,8.64 67.97,7.32 66.24,5.59 62.99,5.59 61.47,7.11 57.71,7.11 56.59,8.23 56.39,8.23 B4ALT.B(-)
L4
  Bottom 0.152: R16.1 48.67,5.08 51.82,8.23 B3.G(-)
L4B  (via drill 0.3)
  Top 0.152: v27.94,25.4 26.62,25.4 25.6,26.42 21.84,26.42 21.74,26.31 20.73,26.31 19.81,27.23 B5.B(-)
  Bottom 0.152: v27.94,25.4 R30.1
L5
  Bottom 0.152: R15.1 47.85,6.4 48.46,6.4 50.29,8.23 B3.R(-)
L5B
  Bottom 0.152: R29.1 40.64,26.52 40.44,26.52 38.71,28.25 35.97,28.25 35.05,27.33 B6.B(-)
L6
  Bottom 0.152: R14.1 65.63,6.4 65.63,6.81 67.06,8.23 B4.G(-) 66.95,8.23 66.04,9.14 58.01,9.14 55.17,11.99 54.86,11.99 B4ALT.G(-)
L6B
  Bottom 0.152: R28.1 45.21,21.64 44.81,22.05 44.7,22.05 44.5,22.25 44.5,24.79 46.13,26.42 49.48,26.42 50.29,27.23 B7.B(-)
L7
  Top 0.152: B4.R(-) 65.53,8.33 65.23,8.33 63.91,9.65 61.67,9.65 60.15,11.18 57.2,11.18 56.39,11.99 B4ALT.R(-)
  Bottom 0.152: R13.1 65.53,14.02 65.33,14.02 64.62,14.73 62.79,14.73 61.06,13.01 57.4,13.01 56.39,11.99 B4ALT.R(-)
L7B
  Bottom 0.152: B8.B(-) 65.53,25.4 | 65.53,25.4 64.72,24.59 57.71,24.59 56.69,23.57 56.39,23.57 B8ALT.B(-) | 65.53,25.4 R27.1
L8  (via drill 0.3)
  Top 0.152: v25.81,25.4 23.47,25.4 21.64,23.57 21.34,23.57 B5.G(-)
  Bottom 0.152: v25.81,25.4 26.62,26.21 26.62,26.42 R12.1
L8G
  Bottom 0.152: B10.G(-) 82.3,23.57 80.57,21.84 R26.1 80.77,22.15 70.1,22.15 69.09,23.16 69.09,23.88 70.1,24.89 B10ALT.G(-)
L9  (via drill 0.3)
  Top 0.152: v23.06,25.81 22.05,25.81 19.81,23.57 B5.R(-)
  Bottom 0.152: v23.06,25.81 23.67,26.42 25.4,26.42 R11.1
L9R
  Bottom 0.152: B10.R(-) 80.77,23.57 80.37,23.98 80.37,24.99 R25.1 80.26,25.09 73.76,25.09 71.63,27.23 B10ALT.R(-)
L10  (via drill 0.3)
  Top 0.152: v41.25,25.2 38.2,25.2 36.58,23.57 B6.G(-)
  Bottom 0.152: v41.25,25.2 41.86,25.81 41.86,26.42 R10.1
L10B  (via drill 0.3)
  Top 0.152: v78.33,24.49 80.77,26.92 B10.B(-)
  Bottom 0.152: R24.1 80.37,28.75 80.37,27.74 80.77,27.33 B10.B(-) | v78.33,24.49 72.85,24.49 71.93,23.57 71.63,23.57 B10ALT.B(-)
L11  (via drill 0.3)
  Top 0.152: v42.37,25.4 41.86,25.4 41.45,25.81 38.2,25.81 36.78,24.38 35.87,24.38 35.05,23.57 B6.R(-)
  Bottom 0.152: R9.1 43.18,26.21 v42.37,25.4
L11G  (via drill 0.3)
  Top 0.152: v77.83,10.67 79.96,10.67 82.3,8.33 B9.G(-)
  Bottom 0.152: R23.1 82.91,7.62 82.3,8.23 B9.G(-) | v77.83,10.67 75.49,13.01 71.22,13.01 70.31,12.09 70.1,12.09 B9ALT.G(-)
L12
  Bottom 0.152: R8.1 46.53,22.86 46.84,22.55 50.9,22.55 51.82,23.47 B7.G(-)
L12R  (via drill 0.3)
  Top 0.152: v79.05,10.06 80.77,8.33 B9.R(-)
  Bottom 0.152: R22.1 84.23,6.4 82.6,6.4 80.77,8.23 B9.R(-) | v79.05,10.06 73.86,10.06 71.93,11.99 71.63,11.99 B9ALT.R(-)
L13
  Bottom 0.152: R7.1 45.31,24.18 46.63,24.18 46.84,24.38 49.48,24.38 50.29,23.57 B7.R(-)
L13B
  Bottom 0.152: B9.B(-) 80.77,12.09 81.69,13.01 82.7,13.01 84.23,11.48 84.23,8.94 R21.1 84.33,8.94 85.04,8.23 85.04,5.69 84.94,5.59 82.91,5.59 81.58,6.91 73.15,6.91 71.83,8.23 71.63,8.23 B9ALT.B(-)
L14
  Bottom 0.152: B8.G(-) 67.06,23.57 68.07,24.59 68.07,27.64 66.55,29.16 65.63,29.16 R6.1 65.53,29.16 64.82,28.45 56.19,28.45 55.07,27.33 54.86,27.33 B8ALT.G(-)
L15  (via drill 0.3)
  Top 0.152: v58.42,25.2 63.91,25.2 65.53,23.57 B8.R(-)
  Bottom 0.152: B8.R(-) 65.53,21.64 R5.1 | v58.42,25.2 56.39,27.23 B8ALT.R(-)
N$2  (via drill 0.3)
  Top 0.152: v91.34,20.73 81.38,30.68 77.11,30.68 76.71,31.09 74.47,31.09 71.63,28.25 62.08,28.25 v61.37,27.53
  Bottom 0.152: v91.34,20.73 94.89,17.17 96.11,17.17 IC3.13 | v61.37,27.53 61.37,27.13 63.09,25.4 R27.2
N$3  (via drill 0.3)
  Top 0.152: v92.86,22.15 92.86,22.45 v83.11,32.21 | v43.69,25.09 43.69,23.37 v42.57,22.25
  Bottom 0.152: v92.86,22.15 92.86,19.71 94.79,17.78 96.11,17.78 IC3.12 | v83.11,32.21 79.76,32.21 77.11,34.85 48.36,34.85 47.14,33.63 47.14,30.18 47.75,29.57 47.75,29.16 v43.69,25.09 | v42.57,22.25 42.77,22.25 43.38,21.64 43.59,21.64 R28.2
N$4  (via drill 0.3)
  Top 0.152: v2.85,10.67 2.85,8.84 10.97,0.71 51.31,0.71 v55.78,5.18 | v59.03,6.5 60.35,7.82 v60.35,10.16
  Bottom 0.152: v2.85,10.67 2.85,9.75 IC2.13 | v55.78,5.18 57.71,5.18 v59.03,6.5 | v60.35,10.16 60.35,11.79 62.48,13.92 63.91,13.92 R13.2
N$5  (via drill 0.3)
  Top 0.152: v11.07,13.31 12.09,13.31 12.6,12.8 13.31,12.8 14.02,12.09 14.02,9.65 18.39,5.28 26.92,5.28 27.33,5.69 28.35,5.69 29.97,7.32 36.98,7.32 39.22,9.55 44.6,9.55 47.35,6.81 v54.15,6.81 | v58.22,6.5 58.83,5.89 59.44,5.89 60.45,6.91 v62.89,6.91
  Bottom 0.152: v11.07,13.31 9.14,13.31 8.53,12.7 5.89,12.7 3.45,10.26 3.45,9.75 IC2.12 | v54.15,6.81 57.91,6.81 v58.22,6.5 | v62.89,6.91 63.4,6.91 63.91,6.4 R14.2
N$6  (via drill 0.3)
  Top 0.152: v95,18.39 94.69,18.39 91.24,14.94 v85.24,14.94 | v67.26,19.3 64.01,22.55 54.46,22.55 v52.73,24.28 | v47.14,29.36 v51.1,29.36
  Bottom 0.152: v95,18.39 96.11,18.39 IC3.11 | v85.24,14.94 82.5,17.68 68.89,17.68 v67.26,19.3 | v52.73,24.28 52.73,26.82 52.83,26.92 52.83,27.64 v51.1,29.36 | v47.14,29.36 46.94,29.36 44.91,27.33 41.35,27.33 40.64,28.04 R29.2
N$7  (via drill 0.3)
  Top 0.152: v4.67,10.67 5.49,10.67 9.04,7.11 11.89,7.11 v16.87,2.13 | v28.35,2.13 29.97,3.76 36.47,3.76 36.58,3.66 37.49,3.66 37.69,3.86 39.22,3.86 40.64,5.28 v44.91,5.28
  Bottom 0.152: v4.67,10.67 4.17,10.16 4.17,9.75 IC2.11 | v28.35,2.13 v16.87,2.13 | v44.91,5.28 45.92,6.3 46.13,6.3 R15.2
N$9  (via drill 0.3)
  Top 0.152: v10.57,3.66 11.38,3.66 14.02,1.02 42.16,1.02 v45.11,3.96
  Bottom 0.152: v10.57,3.66 9.55,3.66 4.78,8.43 4.78,9.65 IC2.10 | v45.11,3.96 45.11,4.17 46.02,5.08 R16.2
N$10  (via drill 0.3)
  Top 0.152: v5.38,8.64 5.89,8.64 v7.82,6.71 | v27.33,4.88 28.04,4.88 30.18,7.01 37.19,7.01 39.12,8.94 v44.2,8.94
  Bottom 0.152: v5.38,8.64 IC2.9 | v7.82,6.71 9.65,4.88 v27.33,4.88 | v44.2,8.94 43.28,8.94 43.18,9.04 R17.2
N$11  (via drill 0.3)
  Top 0.152: v36.78,4.27 36.78,5.49 39.32,8.03 v39.62,8.03
  Bottom 0.152: v36.78,4.27 36.78,2.03 36.07,1.32 13.72,1.32 10.77,4.27 9.45,4.27 6.1,7.62 6.1,9.65 IC2.8 | v39.62,8.03 39.83,8.03 40.03,8.23 41.15,8.23 41.96,9.04 R18.2
N$12  (via drill 0.3)
  Top 0.152: v6.5,10.67 6.5,10.16 9.25,7.42 v12.39,7.42
  Bottom 0.152: v6.5,10.67 6.6,10.57 6.6,9.75 IC2.7 | v12.39,7.42 14.43,9.45 16.15,9.45 17.37,10.67 24.69,10.67 25.4,9.96 26.01,9.96 26.62,9.35 26.62,9.14 R19.2
N$13  (via drill 0.3)
  Top 0.152: v93.47,20.73 93.47,23.06 83.72,32.82 70.71,32.82 69.8,31.9 69.8,29.46 69.09,28.75 63.8,28.75 v59.13,33.43 | v47.75,33.43 39.83,33.43 38.1,31.7 34.04,31.7 v31.9,29.57
  Bottom 0.152: v93.47,20.73 95.1,19.1 96.11,19.1 IC3.10 | v47.75,33.43 v59.13,33.43 | v31.9,29.57 30.58,28.25 27.94,28.25 R30.2
N$14  (via drill 0.3)
  Top 0.152: v95,20.02 95,19.2 91.03,15.24 85.75,15.24 85.14,15.85 v81.79,15.85
  Bottom 0.152: v95,20.02 95.2,19.81 96.11,19.81 IC3.9 | v81.79,15.85 79.25,13.31 66.34,13.31 66.04,13.01 62.08,13.01 61.57,12.5 61.57,11.68 63.09,10.16 R31.2
N$15  (via drill 0.3)
  Top 0.152: v97.13,20.32 97.13,19.1 96.52,18.49 v96.52,14.02
  Bottom 0.152: v97.13,20.32 96.22,20.32 IC3.8 | v96.52,14.02 96.52,13.21 94.89,11.58 94.89,7.32 94.39,6.81 92.66,6.81 88.29,2.44 47.55,2.44 46.23,3.76 R32.2
N$16  (via drill 0.3)
  Top 0.152: v94.49,20.93 93.67,20.12 92.76,20.12 v88.8,24.08 | v56.49,20.12 55.27,20.12 53.03,17.88 48.67,17.88 v46.63,15.85
  Bottom 0.152: v94.49,20.93 96.11,20.93 IC3.7 | v88.8,24.08 88.09,24.08 81.99,17.98 69.39,17.98 67.26,20.12 61.87,20.12 61.47,19.71 59.23,19.71 58.83,20.12 v56.49,20.12 | v46.63,15.85 43.99,15.85 40.64,12.5 40.23,12.5 38.2,10.46 38.2,9.45 38.61,9.04 40.64,9.04 R33.2
N$17  (via drill 0.3)
  Top 0.152: v95.1,21.64 95.1,20.73 95.61,20.22 95.61,18.19 91.34,13.92 84.73,13.92 84.33,13.51 79.45,13.51 v79.05,13.92 | v54.36,17.58 50.39,17.58 v47.14,14.33 | v37.9,12.9 v41.86,12.9 | v30.79,13.01 v34.34,13.01
  Bottom 0.152: v95.1,21.64 96.11,21.64 IC3.6 | v79.05,13.92 78.64,13.92 76.71,15.85 74.47,15.85 74.07,15.44 69.39,15.44 67.26,17.58 v54.36,17.58 | v47.14,14.33 46.02,13.21 42.16,13.21 v41.86,12.9 | v37.9,12.9 37.08,12.9 36.98,13.01 v34.34,13.01 | v30.79,13.01 28.85,11.07 28.85,10.06 27.94,9.14 R34.2
N$18  (via drill 0.3)
  Top 0.152: v88.8,17.48 88.8,18.09 v85.04,21.84
  Bottom 0.152: v88.8,17.48 89.71,16.56 90.22,16.56 IC3.15 | R26.2 v85.04,21.84
N$19  (via drill 0.3)
  Top 0.152: v7.21,11.07 7.21,9.96 9.14,8.03 v13.82,8.03
  Bottom 0.152: v7.21,11.07 7.32,10.97 7.32,9.75 IC2.6 | v13.82,8.03 15.24,8.03 17.58,10.36 24.18,10.36 25.4,9.14 R20.2
N$20  (via drill 0.3)
  Top 0.152: v2.74,17.88 2.74,20.02 7.21,24.49 v11.48,24.49 | v11.58,27.53 11.58,28.96 v9.45,31.09 | v23.06,33.33 23.06,31.9 v25.7,29.26
  Bottom 0.152: v2.74,17.88 2.13,17.27 2.13,15.54 IC2.15 | v11.48,24.49 11.48,25.5 11.79,25.81 11.79,27.33 v11.58,27.53 | v9.45,31.09 9.45,32.31 8.53,33.22 8.53,33.93 9.55,34.95 21.44,34.95 v23.06,33.33 | v25.7,29.26 26.72,28.25 R12.2
N$21  (via drill 0.3)
  Top 0.152: v2.74,17.07 2.13,17.68 2.13,20.32 6.91,25.09 11.58,25.09 13.82,27.33 13.82,30.18 14.94,31.29 v15.85,31.29
  Bottom 0.152: v2.74,17.07 2.74,15.54 IC2.16 | v15.85,31.29 18.39,28.75 25.2,28.75 25.4,28.55 R11.2
N$22  (via drill 0.3)
  Top 0.152: v6.2,12.09 v4.37,13.92 | v11.68,14.02 15.85,18.19 15.85,20.12 16.56,20.83 v22.25,20.83 | v26.62,23.06 v24.38,20.83 | v35.56,24.89 36.78,24.89 v41.15,29.26
  Bottom 0.152: v4.37,13.92 3.45,14.83 3.45,15.44 IC2.17 | v6.2,12.09 8.43,12.09 9.04,12.7 11.28,12.7 11.68,13.11 v11.68,14.02 | v24.38,20.83 v22.25,20.83 | v26.62,23.06 29.57,23.06 31.39,24.89 v35.56,24.89 | v41.15,29.26 41.15,29.06 41.96,28.25 R10.2
N$23  (via drill 0.3)
  Top 0.152: v5.99,18.29 5.99,21.13 7.92,23.06 11.28,23.06 v12.39,21.95 | v15.95,26.01 15.95,26.82 15.85,26.92 15.85,27.74 16.36,28.25 21.84,28.25 22.35,27.74 29.67,27.74 v29.77,27.64
  Bottom 0.152: v5.99,18.29 4.17,16.46 4.17,15.54 IC2.18 | v12.39,21.95 13.31,21.95 14.02,22.66 14.02,24.08 v15.95,26.01 | v29.77,27.64 30.99,27.64 32.11,28.75 39.83,28.75 40.95,29.87 41.66,29.87 43.18,28.35 R9.2
N$24  (via drill 0.3)
  Top 0.152: v5.69,14.12 6.6,14.12 v8.94,11.79 | v12.7,9.86 13.92,8.64 14.02,8.64 v19.91,2.74 | v27.33,2.74 28.35,2.74 29.06,3.45 v29.06,5.08 | v30.89,7.92 30.89,8.43 32.92,10.46 36.37,10.46 v36.78,10.87
  Bottom 0.152: v5.69,14.12 4.78,15.04 4.78,15.44 IC2.19 | v8.94,11.79 10.77,11.79 v12.7,9.86 | v27.33,2.74 v19.91,2.74 | v29.06,5.08 29.06,6.1 v30.89,7.92 | v36.78,10.87 39.32,13.41 39.32,15.04 38.41,15.95 38.41,18.9 42.37,22.86 R8.2
N$25  (via drill 0.3)
  Top 0.152: v6.71,18.69 11.28,18.69 v11.89,18.09 | v29.06,14.94 30.89,16.76 38.1,16.76 v40.23,14.63 | v40.44,21.74 v41.25,20.93
  Bottom 0.152: v6.71,18.69 6.71,18.19 5.38,16.87 5.38,15.54 IC2.20 | v11.89,18.09 12.39,18.09 13.01,17.48 13.21,17.48 14.02,16.66 14.02,14.12 14.83,13.31 23.27,13.31 24.89,14.94 v29.06,14.94 | v40.23,14.63 40.23,15.44 39.62,16.05 39.62,19.51 41.05,20.93 v41.25,20.93 | v40.44,21.74 40.74,21.74 43.08,24.08 43.59,24.08 R7.2
N$26  (via drill 0.3)
  Top 0.152: v8.13,25.7 10.67,25.7 10.97,25.4 11.38,25.4 13.51,27.53 13.51,30.58 v15.34,32.41 | v34.34,30.99 37.59,30.99 38,31.39 38.81,31.39 40.23,32.82 v52.12,32.82
  Bottom 0.152: v8.13,25.7 7.32,24.89 7.32,18.29 6.1,17.07 6.1,15.54 IC2.21 | v15.34,32.41 15.65,32.41 15.75,32.51 21.23,32.51 22.66,31.09 24.08,31.09 24.79,30.38 29.26,30.38 29.97,31.09 34.24,31.09 v34.34,30.99 | v52.12,32.82 60.35,32.82 63.91,29.26 R6.2
N$27  (via drill 0.3)
  Top 0.152: v6.71,16.66 9.55,16.66 v11.38,14.83 | v12.5,13.72 15.54,16.76 v24.18,16.76 | v35.26,17.88 38.51,17.88 38.81,17.58 v41.35,17.58 | v47.45,17.58 47.85,17.58 52.43,22.15 62.69,22.15 v62.89,21.95
  Bottom 0.152: v6.71,16.66 6.71,15.54 IC2.22 | v11.38,14.83 11.68,14.83 12.5,14.02 v12.5,13.72 | v24.18,16.76 25.3,17.88 v35.26,17.88 | v47.45,17.58 v41.35,17.58 | v62.89,21.95 63.6,21.95 63.91,21.64 R5.2
N$28  (via drill 0.3)
  Top 0.152: v83.11,24.59 v88.8,18.9
  Bottom 0.152: v88.8,18.9 88.8,18.29 89.92,17.17 90.22,17.17 IC3.16 | v83.11,24.59 82.5,24.59 82.09,24.99 R25.2
N$29  (via drill 0.3)
  Top 0.152: v90.83,15.85 90.83,20.42 v83.11,28.14
  Bottom 0.152: v90.83,15.85 91.03,16.05 91.03,17.37 90.73,17.68 90.32,17.68 IC3.17 | v83.11,28.14 82.8,28.14 82.09,28.85 R24.2
N$30
  Bottom 0.152: R23.2 86.36,7.62 91.44,12.7 91.44,17.68 90.73,18.39 90.32,18.39 IC3.18
N$31
  Bottom 0.152: IC3.19 90.32,19 90.73,19 92.66,17.07 92.66,11.28 91.85,10.46 90.22,10.46 86.16,6.4 85.95,6.4 R22.2
N$32
  Bottom 0.152: IC3.20 90.22,19.71 88.8,19.71 88.19,19.1 88.19,9.96 87.17,8.94 85.95,8.94 R21.2

### Text on the board
_bsilk: v07-13 | BI10-2x5RGB | SKAARHOJ 2013 | GITHUB: SKAARHOJ-Open-Engineering